# Altium schematic sheet Magnetometer.SchDoc
size A4
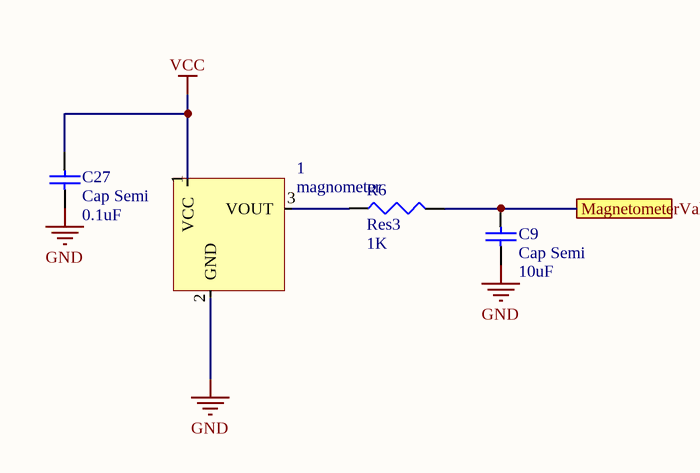
[diagram p0: Magnetometer.SchDoc]

## Parts
1  magnometer  [SIP-3]
C9  Cap Semi  value 10uF  [1608[0603]]
C27  Cap Semi  value 0.1uF  [1608[0603]]
R6  Res3  value 1K  [J1-0603]

## Ports
MagnetometerVal

## Nets
GND: 1.2(GND) C9.1 C27.1
VCC: 1.1(VCC) C27.2
MagnetometerVal: C9.2 R6.2 ; port MagnetometerVal
Net1_3: 1.3(VOUT) R6.1

## Library data of the parts
C9 C27 = Cap Semi: Capacitor (Semiconductor SIM Model); Published: 8-Jun-2000; LatestRevisionDate: 29-May-2009; LatestRevisionNote: IPC-7351 Footprint Added.; PackageReference: C1206; Publisher: Altium Limited; PackageDescription: Chip Capacitor
R6 = Res3: Resistor; Published: 8-Jun-2000; LatestRevisionDate: 29-May-2009; LatestRevisionNote: IPC-7351 Footprint Added.; PackageReference: J1-0603; Publisher: Altium Limited; PackageDescription: Chip Resistor